# Altium schematic sheet W5500.SchDoc
size A4
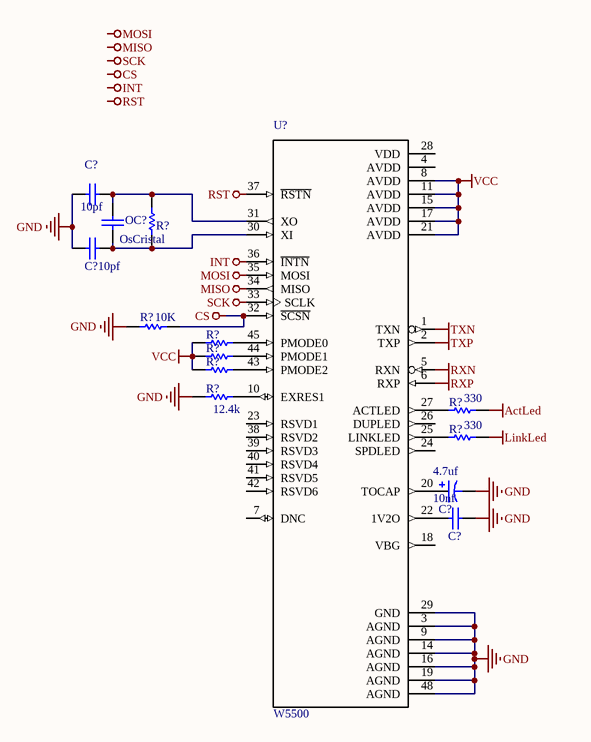
[diagram p0: W5500.SchDoc]

## Parts
(Parts that share a designator on the sheet are numbered #1, #2 ... from top to bottom, then left to right.)
C?#1  10pf  [Capacitor de paso 1]
C?#2  10pf  [Capacitor de paso 1]
C?#3  4.7uf  [Electrolytic Capacitor S]
C?#4  10nf  [Capacitor de paso 1]
OC?  OsCristal  [RAD-0.3]
R?#1  Resistor  [Resistor 1/4 W]  (value not drawn)
R?#2  10K  [Resistor 1/4 W]
R?#3  Resistor  [Resistor 1/4 W]  (value not drawn)
R?#4  Resistor  [Resistor 1/4 W]  (value not drawn)
R?#5  Resistor  [Resistor 1/4 W]  (value not drawn)
R?#6  12.4k  [Resistor 1/4 W]
R?#7  330  [Resistor 1/4 W]
R?#8  330  [Resistor 1/4 W]
U?  W5500  [QFP50P900X900X160-48N]

## Nets
ActLed: R?#7.2
CS: R?#2.2 U?.32(~{SCSN})
GND: C?#1.2 C?#2.2 C?#3.2 C?#4.1 R?#2.1 R?#6.1 U?.3(AGND) U?.9(AGND) U?.14(AGND) U?.16(AGND) U?.19(AGND) U?.29(GND) U?.48(AGND)
INT: U?.36(~{INTN})
LinkLed: R?#8.2
MISO: U?.34(MISO)
MOSI: U?.35(MOSI)
RST: U?.37(~{RSTN})
RXN: U?.5(RXN)
RXP: U?.6(RXP)
SCK: U?.33(SCLK)
TXN: U?.1(TXN)
TXP: U?.2(TXP)
VCC: R?#3.1 R?#4.1 R?#5.1 U?.8(AVDD) U?.11(AVDD) U?.15(AVDD) U?.17(AVDD) U?.21(AVDD)
NetC?#1_1: C?#1.1 OC?.2 R?#1.2 U?.31(XO)
NetC?#2_1: C?#2.1 OC?.1 R?#1.1 U?.30(XI)
NetC?#3_1: C?#3.1 U?.20(TOCAP)
NetC?#4_2: C?#4.2 U?.22(1V2O)
NetR?#3_2: R?#3.2 U?.45(PMODE0)
NetR?#4_2: R?#4.2 U?.44(PMODE1)
NetR?#5_2: R?#5.2 U?.43(PMODE2)
NetR?#6_2: R?#6.2 U?.10(EXRES1)
NetR?#7_1: R?#7.1 U?.27(ACTLED)
NetR?#8_1: R?#8.1 U?.25(LINKLED)

Not connected (* = marked no-connect by the designer): U? 4(AVDD) 7(DNC) 18(VBG) 23(RSVD1) 24(SPDLED) 26(DUPLED) 28(VDD) 38(RSVD2) 39(RSVD3) 40(RSVD4) 41(RSVD5) 42(RSVD6)

## Notes on the sheet
- Labels drawn without touching a wire or pin: CS, INT, MISO, MOSI, RST, SCK

## Library data of the parts
C?#1 C?#2 C?#4 = Capacitor de paso
C?#3 = Capacitor Electrolitico
OC? = Cap: Capacitor; Value: 100pF; Published: 8-Jun-2000; LatestRevisionDate: 17-Jul-2002; LatestRevisionNote: Re-released for DXP Platform.; PackageReference: RAD-0.3; Publisher: Altium Limited; PackageDescription: Radial Cap, Thru-Hole; 2 Leads; 0.3 in Pin Spacing
R?#2 R?#6-R?#8 = Resistor
U? = W5500: Victor Pure White Collection Wood Tidy Tower Organizer; MF: WIZnet; Package: LQFP-48 Victor Technologies; Price: None; Availability: Unavailable; MP: W5500; SnapEDA_Link: https://www.snapeda.com/parts/W5500/WIZnet/view-part/?ref=snap; Value: *